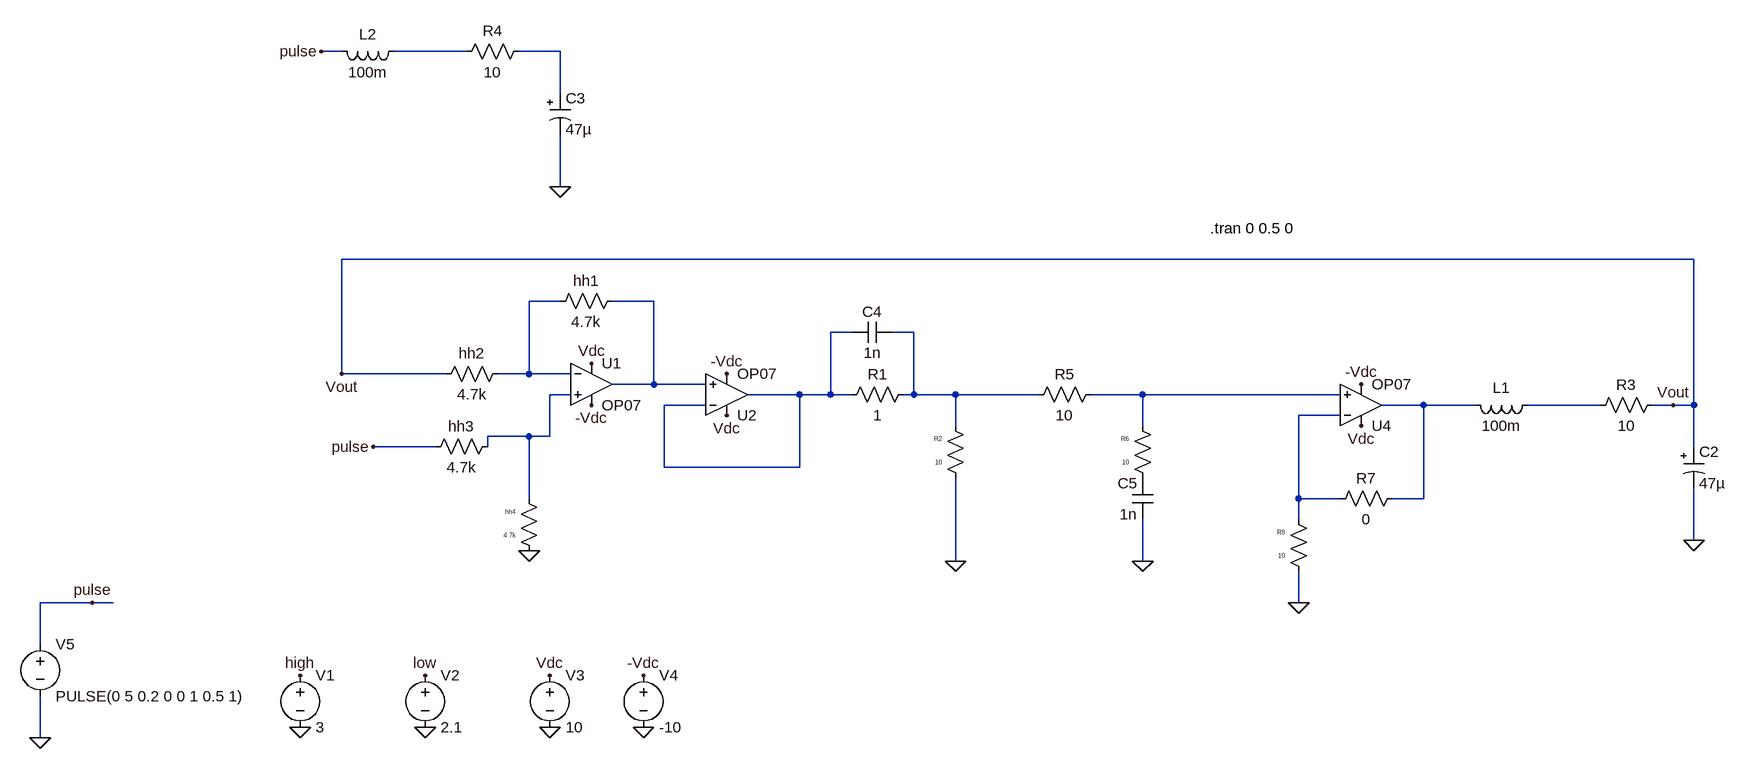
[diagram p0: schematic leadlagcontrol.asc]
leadlagcontrol.asc, the LTspice schematic file:
Version 4
SHEET 1 1912 1376
WIRE -2208 112 -2240 112
WIRE -2016 112 -2128 112
WIRE -1872 112 -1936 112
WIRE -1872 176 -1872 112
WIRE -1872 320 -1872 240
WIRE -128 432 -2208 432
WIRE -1872 496 -1920 496
WIRE -1728 496 -1792 496
WIRE -1424 544 -1456 544
WIRE -1328 544 -1360 544
WIRE -2208 608 -2208 432
WIRE -2048 608 -2208 608
WIRE -1920 608 -1920 496
WIRE -1920 608 -1968 608
WIRE -1856 608 -1920 608
WIRE -1728 624 -1728 496
WIRE -1728 624 -1792 624
WIRE -1648 624 -1728 624
WIRE -1856 640 -1888 640
WIRE -1504 640 -1584 640
WIRE -1456 640 -1456 544
WIRE -1456 640 -1504 640
WIRE -1424 640 -1456 640
WIRE -1328 640 -1328 544
WIRE -1328 640 -1344 640
WIRE -1264 640 -1328 640
WIRE -1136 640 -1264 640
WIRE -976 640 -1056 640
WIRE -672 640 -976 640
WIRE -1648 656 -1712 656
WIRE -544 656 -608 656
WIRE -464 656 -544 656
WIRE -272 656 -384 656
WIRE -160 656 -192 656
WIRE -128 656 -128 432
WIRE -128 656 -160 656
WIRE -672 672 -736 672
WIRE -1264 688 -1264 640
WIRE -976 688 -976 640
WIRE -1920 704 -1984 704
WIRE -1888 704 -1888 640
WIRE -1888 704 -1920 704
WIRE -2064 720 -2160 720
WIRE -1984 720 -1984 704
WIRE -128 720 -128 656
WIRE -1712 752 -1712 656
WIRE -1504 752 -1504 640
WIRE -1504 752 -1712 752
WIRE -1920 800 -1920 704
WIRE -736 800 -736 672
WIRE -672 800 -736 800
WIRE -544 800 -544 656
WIRE -544 800 -592 800
WIRE -736 832 -736 800
WIRE -128 864 -128 784
WIRE -1264 896 -1264 768
WIRE -976 896 -976 832
WIRE -2592 960 -2672 960
WIRE -2560 960 -2592 960
WIRE -736 960 -736 912
WIRE -2672 1024 -2672 960
WIRE -2672 1168 -2672 1104
FLAG -2272 1152 0
FLAG -2272 1072 high
FLAG -2080 1152 0
FLAG -2080 1072 low
FLAG -1888 1152 0
FLAG -1888 1072 Vdc
FLAG -1744 1152 0
FLAG -1744 1072 -Vdc
FLAG -2672 1168 0
FLAG -2592 960 pulse
FLAG -1920 880 0
FLAG -1824 592 Vdc
FLAG -2160 720 pulse
FLAG -1824 656 -Vdc
FLAG -1616 672 Vdc
FLAG -1616 608 -Vdc
FLAG -2208 608 Vout
FLAG -1264 896 0
FLAG -128 864 0
FLAG -160 656 Vout
FLAG -1872 320 0
FLAG -2240 112 pulse
FLAG -976 896 0
FLAG -640 688 Vdc
FLAG -640 624 -Vdc
FLAG -736 960 0
SYMBOL voltage -2272 1056 R0
SYMATTR InstName V1
SYMATTR Value 3
SYMBOL voltage -2080 1056 R0
SYMATTR InstName V2
SYMATTR Value 2.1
SYMBOL voltage -1888 1056 R0
SYMATTR InstName V3
SYMATTR Value 10
SYMBOL voltage -1744 1056 R0
SYMATTR InstName V4
SYMATTR Value -10
SYMBOL voltage -2672 1008 R0
SYMATTR InstName V5
SYMATTR Value PULSE(0 5 0.2 0 0 1 0.5 1)
SYMBOL res -1776 480 R90
WINDOW 0 0 56 VBottom 2
WINDOW 3 32 56 VTop 2
SYMATTR InstName hh1
SYMATTR Value 4.7k
SYMBOL res -1952 592 R90
WINDOW 0 0 56 VBottom 2
WINDOW 3 32 56 VTop 2
SYMATTR InstName hh2
SYMATTR Value 4.7k
SYMBOL res -1968 704 R90
WINDOW 0 0 56 VBottom 2
WINDOW 3 32 56 VTop 2
SYMATTR InstName hh3
SYMATTR Value 4.7k
SYMBOL res -1904 896 R180
WINDOW 0 36 76 Left 0
WINDOW 3 36 40 Left 0
SYMATTR InstName hh4
SYMATTR Value 4.7k
SYMBOL Opamps/OP07 -1824 560 R0
SYMATTR InstName U1
SYMBOL Opamps/OP07 -1616 704 M180
SYMATTR InstName U2
SYMBOL res -1328 624 R90
WINDOW 0 0 56 VBottom 2
WINDOW 3 32 56 VTop 2
SYMATTR InstName R1
SYMATTR Value 1
SYMBOL res -1248 784 R180
WINDOW 0 36 76 Left 0
WINDOW 3 36 40 Left 0
SYMATTR InstName R2
SYMATTR Value 10
SYMBOL res -176 640 R90
WINDOW 0 0 56 VBottom 2
WINDOW 3 32 56 VTop 2
SYMATTR InstName R3
SYMATTR Value 10
SYMBOL ind -368 640 R90
WINDOW 0 5 56 VBottom 2
WINDOW 3 32 56 VTop 2
SYMATTR InstName L1
SYMATTR Value 100m
SYMBOL polcap -144 720 R0
SYMATTR InstName C2
SYMATTR Value 47µ
SYMBOL res -1920 96 R90
WINDOW 0 0 56 VBottom 2
WINDOW 3 32 56 VTop 2
SYMATTR InstName R4
SYMATTR Value 10
SYMBOL ind -2112 96 R90
WINDOW 0 5 56 VBottom 2
WINDOW 3 32 56 VTop 2
SYMATTR InstName L2
SYMATTR Value 100m
SYMBOL polcap -1888 176 R0
SYMATTR InstName C3
SYMATTR Value 47µ
SYMBOL cap -1424 560 R270
WINDOW 0 32 32 VTop 2
WINDOW 3 0 32 VBottom 2
SYMATTR InstName C4
SYMATTR Value 1n
SYMBOL res -1040 624 R90
WINDOW 0 0 56 VBottom 2
WINDOW 3 32 56 VTop 2
SYMATTR InstName R5
SYMATTR Value 10
SYMBOL res -960 784 R180
WINDOW 0 36 76 Left 0
WINDOW 3 36 40 Left 0
SYMATTR InstName R6
SYMATTR Value 10
SYMBOL cap -960 832 R180
WINDOW 0 24 56 Left 2
WINDOW 3 24 8 Left 2
SYMATTR InstName C5
SYMATTR Value 1n
SYMBOL Opamps/OP07 -640 720 M180
SYMATTR InstName U4
SYMBOL res -576 784 R90
WINDOW 0 0 56 VBottom 2
WINDOW 3 32 56 VTop 2
SYMATTR InstName R7
SYMATTR Value 0
SYMBOL res -720 928 R180
WINDOW 0 36 76 Left 0
WINDOW 3 36 40 Left 0
SYMATTR InstName R8
SYMATTR Value 10
TEXT -872 384 Left 2 !.tran 0 0.5 0

The netlist it stands for:
* leadlagcontrol.asc
V1 high 0 3
V2 low 0 2.1
V3 Vdc 0 10
V4 -Vdc 0 -10
V5 pulse 0 PULSE(0 5 0.2 0 0 1 0.5 1)
R§hh1 N004 N003 4.7k
R§hh2 N003 Vout 4.7k
R§hh3 N007 pulse 4.7k
R§hh4 0 N007 4.7k
XU1 N007 N003 Vdc -Vdc N004 LT1001  ; OP07, pins In+ In- V+ V- OUT
XU2 N004 N005 Vdc -Vdc N005 LT1001  ; OP07, pins In+ In- V+ V- OUT
R1 N006 N005 1
R2 0 N006 10
R3 Vout N010 10
L1 N010 N009 100m
C2 Vout 0 47µ
R4 N002 N001 10
L2 N001 pulse 100m
C3 N002 0 47µ
C4 N005 N006 1n
R5 N008 N006 10
R6 P001 N008 10
C5 0 P001 1n
XU4 N008 N011 Vdc -Vdc N009 LT1001  ; OP07, pins In+ In- V+ V- OUT
R7 N009 N011 0
R8 0 N011 10
.tran 0 0.5 0
.lib LTC.lib
.backanno
.end